# Altium schematic sheet adc.SchDoc
size A4
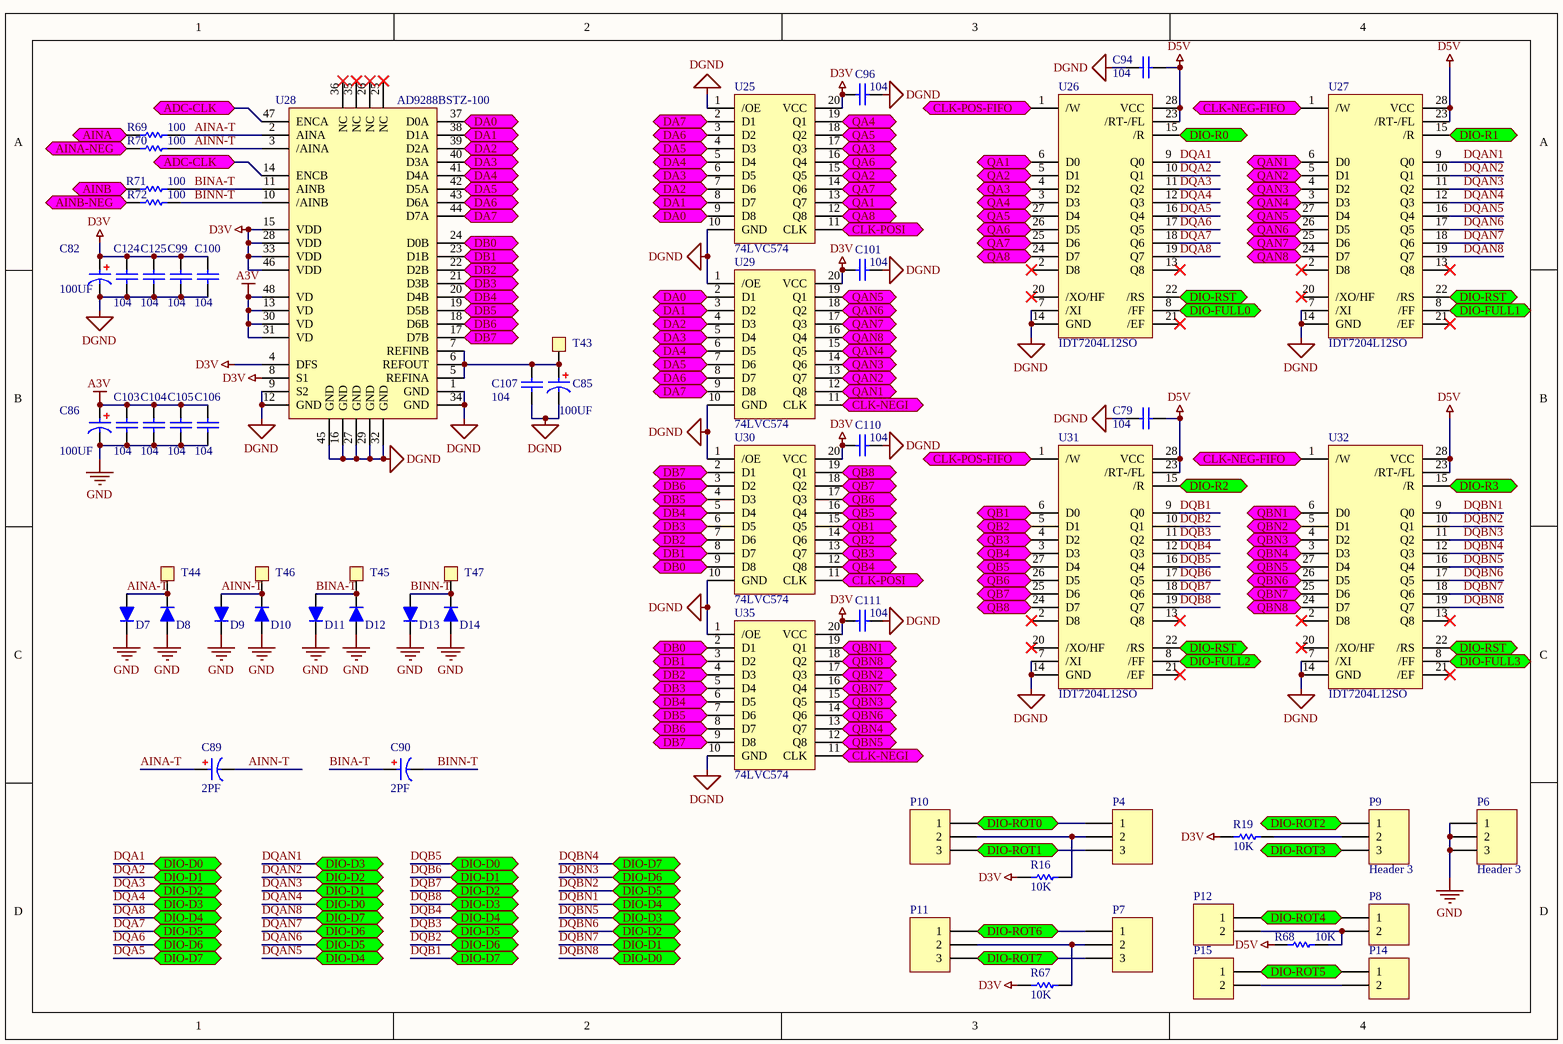
[diagram p0: adc.SchDoc]

## Parts
C79  C104  [0402]  (value not drawn)
C82  100UF  [CAP-T-3630]
C85  100UF  [CAP-T-3630]
C86  100UF  [CAP-T-3630]
C89  2PF  [0603C]
C90  2PF  [0603C]
C94  C104  [0402]  (value not drawn)
C96  C104  [0402]  (value not drawn)
C99  C104  [0402]  (value not drawn)
C100  C104  [0402]  (value not drawn)
C101  C104  [0402]  (value not drawn)
C103  C104  [0402]  (value not drawn)
C104  C104  [0402]  (value not drawn)
C105  C104  [0402]  (value not drawn)
C106  C104  [0402]  (value not drawn)
C107  C104  [0402]  (value not drawn)
C110  C104  [0402]  (value not drawn)
C111  C104  [0402]  (value not drawn)
C124  C104  [0402]  (value not drawn)
C125  C104  [0402]  (value not drawn)
D7  KDS4148U  [LC-SOD-323F]  (value not drawn)
D8  KDS4148U  [LC-SOD-323F]  (value not drawn)
D9  KDS4148U  [LC-SOD-323F]  (value not drawn)
D10  KDS4148U  [LC-SOD-323F]  (value not drawn)
D11  KDS4148U  [LC-SOD-323F]  (value not drawn)
D12  KDS4148U  [LC-SOD-323F]  (value not drawn)
D13  KDS4148U  [LC-SOD-323F]  (value not drawn)
D14  KDS4148U  [LC-SOD-323F]  (value not drawn)
P4  Header 3  [ROTA-3PIN]  (value not drawn)
P6  Header 3  [ROTA-3PIN]
P7  Header 3  [ROTA-3PIN]  (value not drawn)
P8  Header 2  [ROTA-2PIN]  (value not drawn)
P9  Header 3  [ROTA-3PIN]
P10  Header 3  [ROTA-3PIN]  (value not drawn)
P11  Header 3  [ROTA-3PIN]  (value not drawn)
P12  Header 2  [ROTA-2PIN]  (value not drawn)
P14  Header 2  [ROTA-2PIN]  (value not drawn)
P15  Header 2  [ROTA-2PIN]  (value not drawn)
R16  10K  [0402]
R19  10K  [0402]
R67  10K  [0402]
R68  10K  [0402]
R69  100  [0603R]
R70  100  [0603R]
R71  100  [0603R]
R72  100  [0603R]
T43  TP  [TEST_POINT]  (value not drawn)
T44  TP  [TEST_POINT]  (value not drawn)
T45  TP  [TEST_POINT]  (value not drawn)
T46  TP  [TEST_POINT]  (value not drawn)
T47  TP  [TEST_POINT]  (value not drawn)
U25  74LVC574  [TSSOP20]
U26  IDT7204L12SO  [SO28-3]
U27  IDT7204L12SO  [SO28-3]
U28  AD9288BSTZ-100  [LQFP48]
U29  74LVC574  [TSSOP20]
U30  74LVC574  [TSSOP20]
U31  IDT7204L12SO  [SO28-3]
U32  IDT7204L12SO  [SO28-3]
U35  74LVC574  [TSSOP20]

## Ports
ADC-CLK, AINA, AINA-NEG, AINB, AINB-NEG, CLK-NEG-FIFO, CLK-NEGI, CLK-POS-FIFO, CLK-POSI, DA0, DA1, DA2, DA3, DA4, DA5, DA6, DA7, DB0, DB1, DB2, DB3, DB4, DB5, DB6, DB7, DIO-D0, DIO-D1, DIO-D2, DIO-D3, DIO-D4, DIO-D5, DIO-D6, DIO-D7, DIO-FULL0, DIO-FULL1, DIO-FULL2, DIO-FULL3, DIO-R0, DIO-R1, DIO-R2, DIO-R3, DIO-ROT0, DIO-ROT1, DIO-ROT2, DIO-ROT3, DIO-ROT4, DIO-ROT5, DIO-ROT6, DIO-ROT7, DIO-RST, QA1, QA2, QA3, QA4, QA5, QA6, QA7, QA8, QAN1, QAN2, QAN3, QAN4, QAN5, QAN6, QAN7, QAN8, QB1, QB2, QB3, QB4, QB5, QB6, QB7, QB8, QBN1, QBN2, QBN3, QBN4, QBN5, QBN6, QBN7, QBN8

## Nets
A3V: C86.1 C103.1 C104.1 C105.1 C106.1 U28.13(VD) U28.30(VD) U28.31(VD) U28.48(VD)
D3V: C82.1 C96.1 C99.1 C100.1 C101.1 C110.1 C111.1 C124.1 C125.1 R16.1 R19.1 R67.1 U25.20(VCC) U28.4(DFS) U28.8(S1) U28.15(VDD) U28.28(VDD) U28.33(VDD) U28.46(VDD) U29.20(VCC) U30.20(VCC) U35.20(VCC)
D5V: C79.1 C94.1 R68.1 U26.23(/RT-/FL) U26.28(VCC) U27.23(/RT-/FL) U27.28(VCC) U31.23(/RT-/FL) U31.28(VCC) U32.23(/RT-/FL) U32.28(VCC)
DGND: C79.2 C82.2 C85.2 C94.2 C96.2 C99.2 C100.2 C101.2 C107.2 C110.2 C111.2 C124.2 C125.2 U25.1(/OE) U25.10(GND) U26.7(/XI) U26.14(GND) U27.7(/XI) U27.14(GND) U28.1(GND) U28.9(S2) U28.12(GND) U28.16(GND) U28.27(GND) U28.29(GND) U28.32(GND) U28.34(GND) U28.45(GND) U29.1(/OE) U29.10(GND) U30.1(/OE) U30.10(GND) U31.7(/XI) U31.14(GND) U32.7(/XI) U32.14(GND) U35.1(/OE) U35.10(GND)
GND: C86.2 C103.2 C104.2 C105.2 C106.2 D7.2(K) D8.1(A) D9.2(K) D10.1(A) D11.2(K) D12.1(A) D13.2(K) D14.1(A) P6.1 P6.2 P6.3
ADC-CLK: U28.14(ENCB) U28.47(ENCA) ; port ADC-CLK
AINA: R69.2 ; port AINA
AINA-NEG: R70.2 ; port AINA-NEG
AINA-T: C89.1 D7.1(A) D8.2(K) R69.1 T44.1(R) U28.2(AINA)
AINB: R71.2 ; port AINB
AINB-NEG: R72.2 ; port AINB-NEG
AINN-T: C89.2 D9.1(A) D10.2(K) R70.1 T46.1(R) U28.3(/AINA)
BINA-T: C90.1 D11.1(A) D12.2(K) R71.1 T45.1(R) U28.11(AINB)
BINN-T: C90.2 D13.1(A) D14.2(K) R72.1 T47.1(R) U28.10(/AINB)
CLK-NEG-FIFO: U27.1(/W) U32.1(/W) ; port CLK-NEG-FIFO
CLK-NEGI: U29.11(CLK) U35.11(CLK) ; port CLK-NEGI
CLK-POS-FIFO: U26.1(/W) U31.1(/W) ; port CLK-POS-FIFO
CLK-POSI: U25.11(CLK) U30.11(CLK) ; port CLK-POSI
DA0: U25.9(D8) U28.37(D0A) U29.2(D1) ; port DA0
DA1: U25.8(D7) U28.38(D1A) U29.3(D2) ; port DA1
DA2: U25.7(D6) U28.39(D2A) U29.4(D3) ; port DA2
DA3: U25.6(D5) U28.40(D3A) U29.5(D4) ; port DA3
DA4: U25.5(D4) U28.41(D4A) U29.6(D5) ; port DA4
DA5: U25.4(D3) U28.42(D5A) U29.7(D6) ; port DA5
DA6: U25.3(D2) U28.43(D6A) U29.8(D7) ; port DA6
DA7: U25.2(D1) U28.44(D7A) U29.9(D8) ; port DA7
DB0: U28.24(D0B) U30.9(D8) U35.2(D1) ; port DB0
DB1: U28.23(D1B) U30.8(D7) U35.3(D2) ; port DB1
DB2: U28.22(D2B) U30.7(D6) U35.4(D3) ; port DB2
DB3: U28.21(D3B) U30.6(D5) U35.5(D4) ; port DB3
DB4: U28.20(D4B) U30.5(D4) U35.6(D5) ; port DB4
DB5: U28.19(D5B) U30.4(D3) U35.7(D6) ; port DB5
DB6: U28.18(D6B) U30.3(D2) U35.8(D7) ; port DB6
DB7: U28.17(D7B) U30.2(D1) U35.9(D8) ; port DB7
DIO-FULL0: U26.8(/FF) ; port DIO-FULL0
DIO-FULL1: U27.8(/FF) ; port DIO-FULL1
DIO-FULL2: U31.8(/FF) ; port DIO-FULL2
DIO-FULL3: U32.8(/FF) ; port DIO-FULL3
DIO-R0: U26.15(/R) ; port DIO-R0
DIO-R1: U27.15(/R) ; port DIO-R1
DIO-R2: U31.15(/R) ; port DIO-R2
DIO-R3: U32.15(/R) ; port DIO-R3
DIO-ROT0: P4.1 P10.1 ; port DIO-ROT0
DIO-ROT1: P4.3 P10.3 ; port DIO-ROT1
DIO-ROT2: P9.1 ; port DIO-ROT2
DIO-ROT3: P9.3 ; port DIO-ROT3
DIO-ROT4: P8.1 P12.1 ; port DIO-ROT4
DIO-ROT5: P14.1 P15.1 ; port DIO-ROT5
DIO-ROT6: P7.1 P11.1 ; port DIO-ROT6
DIO-ROT7: P7.3 P11.3 ; port DIO-ROT7
DIO-RST: U26.22(/RS) U27.22(/RS) U31.22(/RS) U32.22(/RS) ; port DIO-RST
DQA1: U26.9(Q0) U27.12(Q3) U31.16(Q4) U32.19(Q7) ; port DIO-D0  [also labelled DQAN4, DQB5, DQBN8]
DQA2: U26.10(Q1) U27.11(Q2) U31.17(Q5) U32.18(Q6) ; port DIO-D1  [also labelled DQAN3, DQB6, DQBN7]
DQA3: U26.11(Q2) U27.10(Q1) U31.18(Q6) U32.17(Q5) ; port DIO-D2  [also labelled DQAN2, DQB7, DQBN6]
DQA4: U26.12(Q3) U27.9(Q0) U31.19(Q7) U32.16(Q4) ; port DIO-D3  [also labelled DQAN1, DQB8, DQBN5]
DQA5: U26.16(Q4) U27.19(Q7) U31.9(Q0) U32.12(Q3) ; port DIO-D7  [also labelled DQAN8, DQB1, DQBN4]
DQA6: U26.17(Q5) U27.18(Q6) U31.10(Q1) U32.11(Q2) ; port DIO-D6  [also labelled DQAN7, DQB2, DQBN3]
DQA7: U26.18(Q6) U27.17(Q5) U31.11(Q2) U32.10(Q1) ; port DIO-D5  [also labelled DQAN6, DQB3, DQBN2]
DQA8: U26.19(Q7) U27.16(Q4) U31.12(Q3) U32.9(Q0) ; port DIO-D4  [also labelled DQAN5, DQB4, DQBN1]
QA1: U25.13(Q7) U26.6(D0) ; port QA1
QA2: U25.15(Q5) U26.5(D1) ; port QA2
QA3: U25.17(Q3) U26.4(D2) ; port QA3
QA4: U25.19(Q1) U26.3(D3) ; port QA4
QA5: U25.18(Q2) U26.27(D4) ; port QA5
QA6: U25.16(Q4) U26.26(D5) ; port QA6
QA7: U25.14(Q6) U26.25(D6) ; port QA7
QA8: U25.12(Q8) U26.24(D7) ; port QA8
QAN1: U27.6(D0) U29.12(Q8) ; port QAN1
QAN2: U27.5(D1) U29.13(Q7) ; port QAN2
QAN3: U27.4(D2) U29.14(Q6) ; port QAN3
QAN4: U27.3(D3) U29.15(Q5) ; port QAN4
QAN5: U27.27(D4) U29.19(Q1) ; port QAN5
QAN6: U27.26(D5) U29.18(Q2) ; port QAN6
QAN7: U27.25(D6) U29.17(Q3) ; port QAN7
QAN8: U27.24(D7) U29.16(Q4) ; port QAN8
QB1: U30.15(Q5) U31.6(D0) ; port QB1
QB2: U30.14(Q6) U31.5(D1) ; port QB2
QB3: U30.13(Q7) U31.4(D2) ; port QB3
QB4: U30.12(Q8) U31.3(D3) ; port QB4
QB5: U30.16(Q4) U31.27(D4) ; port QB5
QB6: U30.17(Q3) U31.26(D5) ; port QB6
QB7: U30.18(Q2) U31.25(D6) ; port QB7
QB8: U30.19(Q1) U31.24(D7) ; port QB8
QBN1: U32.6(D0) U35.19(Q1) ; port QBN1
QBN2: U32.5(D1) U35.17(Q3) ; port QBN2
QBN3: U32.4(D2) U35.15(Q5) ; port QBN3
QBN4: U32.3(D3) U35.13(Q7) ; port QBN4
QBN5: U32.27(D4) U35.12(Q8) ; port QBN5
QBN6: U32.26(D5) U35.14(Q6) ; port QBN6
QBN7: U32.25(D6) U35.16(Q4) ; port QBN7
QBN8: U32.24(D7) U35.18(Q2) ; port QBN8
NetC85_1: C85.1 C107.1 T43.1(R) U28.5(REFINA) U28.6(REFOUT) U28.7(REFINB)
NetP4_2: P4.2 P10.2 R16.2
NetP7_2: P7.2 P11.2 R67.2
NetP8_2: P8.2 P12.2 R68.2
NetP9_2: P9.2 R19.2
NetP14_2: P14.2 P15.2

Not connected (* = marked no-connect by the designer): U26 2(D8)* 13(Q8)* 20(/XO/HF)* 21(/EF)*; U27 2(D8)* 13(Q8)* 20(/XO/HF)* 21(/EF)*; U28 25(NC)* 26(NC)* 35(NC)* 36(NC)*; U31 2(D8)* 13(Q8)* 20(/XO/HF)* 21(/EF)*; U32 2(D8)* 13(Q8)* 20(/XO/HF)* 21(/EF)*

## Notes on the sheet
- (in symbol C0.1uF) 104

## Library data of the parts
C79 C94 C96 C99-C101 C103-C107 C110 C111 C124 C125 = C0.1uF: 贴片电容
C82 C85 C86 C89 C90 = C10uF: 贴片电容
D7-D14 = Diode
P4 P6 P7 P9-P11 = Header 3: Header, 3-Pin; LatestRevisionDate: 17-Jul-2002; LatestRevisionNote: Re-released for DXP Platform.; Publisher: Altium Limited
P8 P12 P14 P15 = Header 2: Header, 2-Pin; LatestRevisionDate: 17-Jul-2002; LatestRevisionNote: Re-released for DXP Platform.; Publisher: Altium Limited
R16 R19 R67-R72 = R1M
U28 = AD9288BST-100